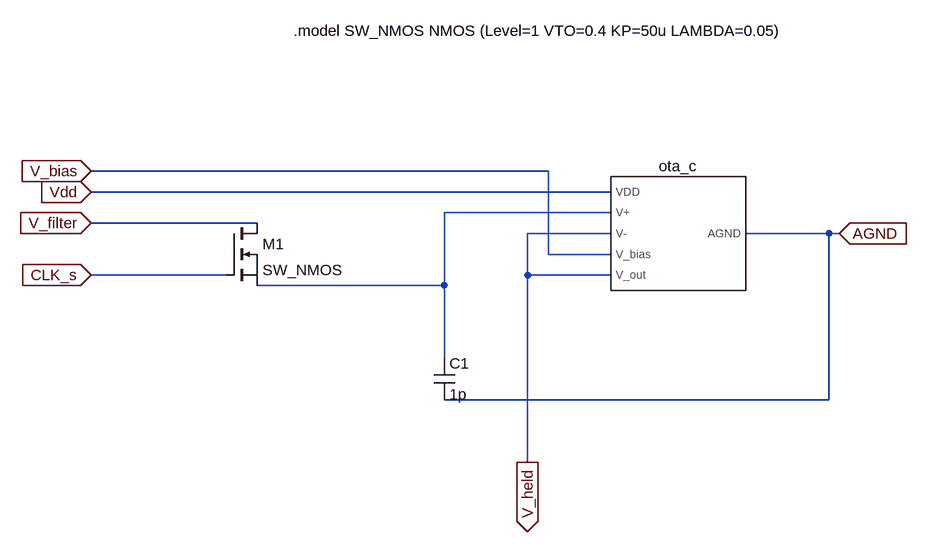
[diagram p0: schematic sample_and_hold.asc]
sample_and_hold.asc, the LTspice schematic file:
Version 4.1
SHEET 1 1152 680
WIRE 576 16 -128 16
WIRE 672 48 -128 48
WIRE 672 80 416 80
WIRE 128 96 -128 96
WIRE 672 112 544 112
WIRE 1008 112 880 112
WIRE 1024 112 1008 112
WIRE 576 144 576 16
WIRE 672 144 576 144
WIRE 80 176 -128 176
WIRE 544 176 544 112
WIRE 672 176 544 176
WIRE 416 192 416 80
WIRE 416 192 128 192
WIRE 416 304 416 192
WIRE 1008 368 1008 112
WIRE 1008 368 416 368
WIRE 544 464 544 176
FLAG -128 96 V_filter
IOPIN -128 96 In
FLAG -128 48 Vdd
IOPIN -128 48 In
FLAG -128 176 CLK_s
IOPIN -128 176 In
FLAG -128 16 V_bias
IOPIN -128 16 In
FLAG 1024 112 AGND
IOPIN 1024 112 In
FLAG 544 464 V_held
IOPIN 544 464 Out
SYMBOL nmos 80 96 R0
SYMATTR InstName M1
SYMATTR Value SW_NMOS
SYMBOL ota_core 768 112 R0
SYMATTR InstName ota_c
SYMBOL cap 400 304 R0
SYMATTR InstName C1
SYMATTR Value 1p
TEXT 184 -200 Left 2 !.model SW_NMOS NMOS (Level=1 VTO=0.4 KP=50u LAMBDA=0.05)

The netlist it stands for:
* sample_and_hold.asc
M1 V_filter CLK_s N001 N001 SW_NMOS
X§ota_c Vdd N001 V_held V_bias V_held AGND ota_core  ; pins VDD V+ V- V_bias V_out AGND
C1 N001 AGND 1p
.model NMOS NMOS
.model PMOS PMOS
.lib standard.mos
.model SW_NMOS NMOS (Level=1 VTO=0.4 KP=50u LAMBDA=0.05)
.backanno
.end